# Altium schematic sheet MTF0320CMIL-04.SchDoc
size A
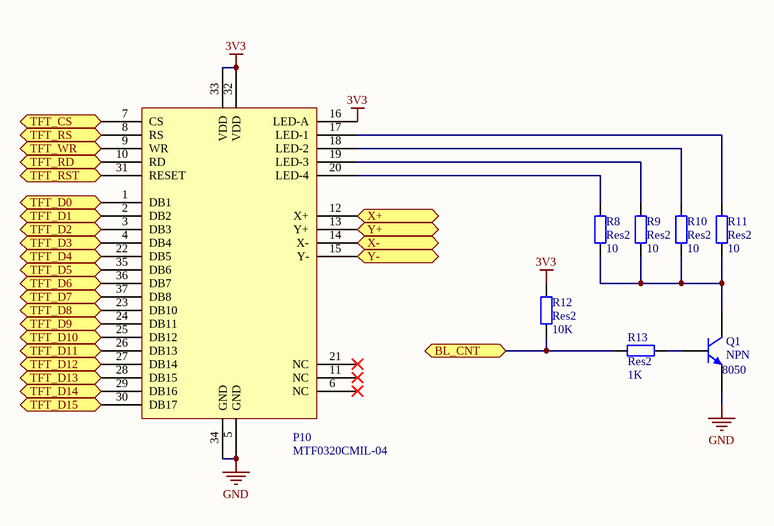
[diagram p0: MTF0320CMIL-04.SchDoc]

## Parts
P10  MTF0320CMIL-04  [37 Pin 1mm pitch FPC]
Q1  NPN  value 8050  [SOT23_M]
R8  Res2  value 10  [0603]
R9  Res2  value 10  [0603]
R10  Res2  value 10  [0603]
R11  Res2  value 10  [0603]
R12  Res2  value 10K  [0603]
R13  Res2  value 1K  [0603]

## Ports
BL_CNT, TFT_CS, TFT_D0, TFT_D1, TFT_D2, TFT_D3, TFT_D4, TFT_D5, TFT_D6, TFT_D7, TFT_D8, TFT_D9, TFT_D10, TFT_D11, TFT_D12, TFT_D13, TFT_D14, TFT_D15, TFT_RD, TFT_RS, TFT_RST, TFT_WR, X+, X-, Y+, Y-

## Nets
3V3: P10.16(LED-A) P10.32(VDD) P10.33(VDD) R12.2
GND: P10.5(GND) P10.34(GND) Q1.3(E)
BL_CNT: R12.1 R13.2 ; port BL_CNT
TFT_CS: P10.7(CS) ; port TFT_CS
TFT_D0: P10.1(DB1) ; port TFT_D0
TFT_D1: P10.2(DB2) ; port TFT_D1
TFT_D2: P10.3(DB3) ; port TFT_D2
TFT_D3: P10.4(DB4) ; port TFT_D3
TFT_D4: P10.22(DB5) ; port TFT_D4
TFT_D5: P10.35(DB6) ; port TFT_D5
TFT_D6: P10.36(DB7) ; port TFT_D6
TFT_D7: P10.37(DB8) ; port TFT_D7
TFT_D8: P10.23(DB10) ; port TFT_D8
TFT_D9: P10.24(DB11) ; port TFT_D9
TFT_D10: P10.25(DB12) ; port TFT_D10
TFT_D11: P10.26(DB13) ; port TFT_D11
TFT_D12: P10.27(DB14) ; port TFT_D12
TFT_D13: P10.28(DB15) ; port TFT_D13
TFT_D14: P10.29(DB16) ; port TFT_D14
TFT_D15: P10.30(DB17) ; port TFT_D15
TFT_RD: P10.10(RD) ; port TFT_RD
TFT_RS: P10.8(RS) ; port TFT_RS
TFT_RST: P10.31(RESET) ; port TFT_RST
TFT_WR: P10.9(WR) ; port TFT_WR
X+: P10.12(X+) ; port X+
X-: P10.14(X-) ; port X-
Y+: P10.13(Y+) ; port Y+
Y-: P10.15(Y-) ; port Y-
NetP10_17: P10.17(LED-1) R11.2
NetP10_18: P10.18(LED-2) R10.2
NetP10_19: P10.19(LED-3) R9.2
NetP10_20: P10.20(LED-4) R8.2
NetQ1_1: Q1.1(C) R8.1 R9.1 R10.1 R11.1
NetQ1_2: Q1.2(B) R13.1

Not connected (* = marked no-connect by the designer): P10 6(NC)* 11(NC)* 21(NC)*

## Library data of the parts
P10 = MTF0320CMIL-04: 3.2" TFT LCD module with touch panel
Q1 = NPN: NPN Bipolar Transistor; pin to pad: 2>3 3>2; Supplier Part Number 1: MMSS8050-H-TPMSDKR-ND; Supplier 1: Digi-Key
R8-R13 = Res2: Resistor; Supplier 1: Digi-Key
  R8-R11: Supplier Part Number 1: 311-10GRDKR-ND
  R12: Supplier Part Number 1: 311-10KGRDKR-ND
  R13: Supplier Part Number 1: 311-1.0KGRDKR-ND